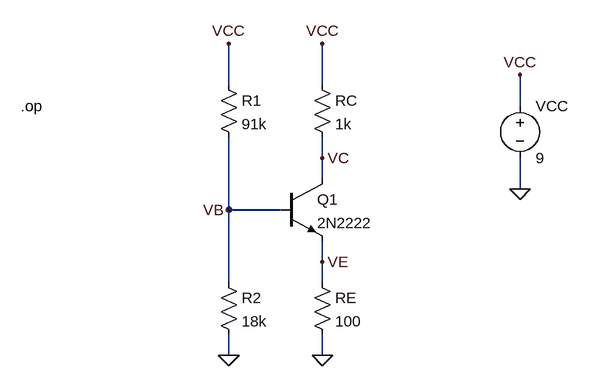
[diagram p0: schematic Perc-03-01-operatingpoint.asc]
Perc-03-01-operatingpoint.asc, the LTspice schematic file:
Version 4
SHEET 1 880 680
WIRE 128 48 128 -16
WIRE 272 48 272 -16
WIRE 576 80 576 32
WIRE 272 160 272 128
WIRE 272 192 272 160
WIRE 576 208 576 160
WIRE 128 240 128 128
WIRE 208 240 128 240
WIRE 272 320 272 288
WIRE 128 352 128 240
WIRE 272 352 272 320
WIRE 128 464 128 432
WIRE 272 464 272 432
FLAG 272 464 0
FLAG 128 464 0
FLAG 128 -16 VCC
FLAG 272 -16 VCC
FLAG 576 208 0
FLAG 576 32 VCC
FLAG 128 240 VB
FLAG 272 320 VE
FLAG 272 160 VC
SYMBOL npn 208 192 R0
SYMATTR InstName Q1
SYMATTR Value 2N2222
SYMBOL res 256 32 R0
SYMATTR InstName RC
SYMATTR Value 1k
SYMBOL res 112 32 R0
SYMATTR InstName R1
SYMATTR Value 91k
SYMBOL res 112 336 R0
SYMATTR InstName R2
SYMATTR Value 18k
SYMBOL res 256 336 R0
SYMATTR InstName RE
SYMATTR Value 100
SYMBOL voltage 576 64 R0
SYMATTR InstName VCC
SYMATTR Value 9
TEXT -192 80 Left 2 !.op

The netlist it stands for:
* Perc-03-01-operatingpoint.asc
Q1 VC VB VE 0 2N2222
RC VCC VC 1k
R1 VCC VB 91k
R2 VB 0 18k
RE VE 0 100
VCC VCC 0 9
.model NPN NPN
.model PNP PNP
.lib standard.bjt
.op
.backanno
.end